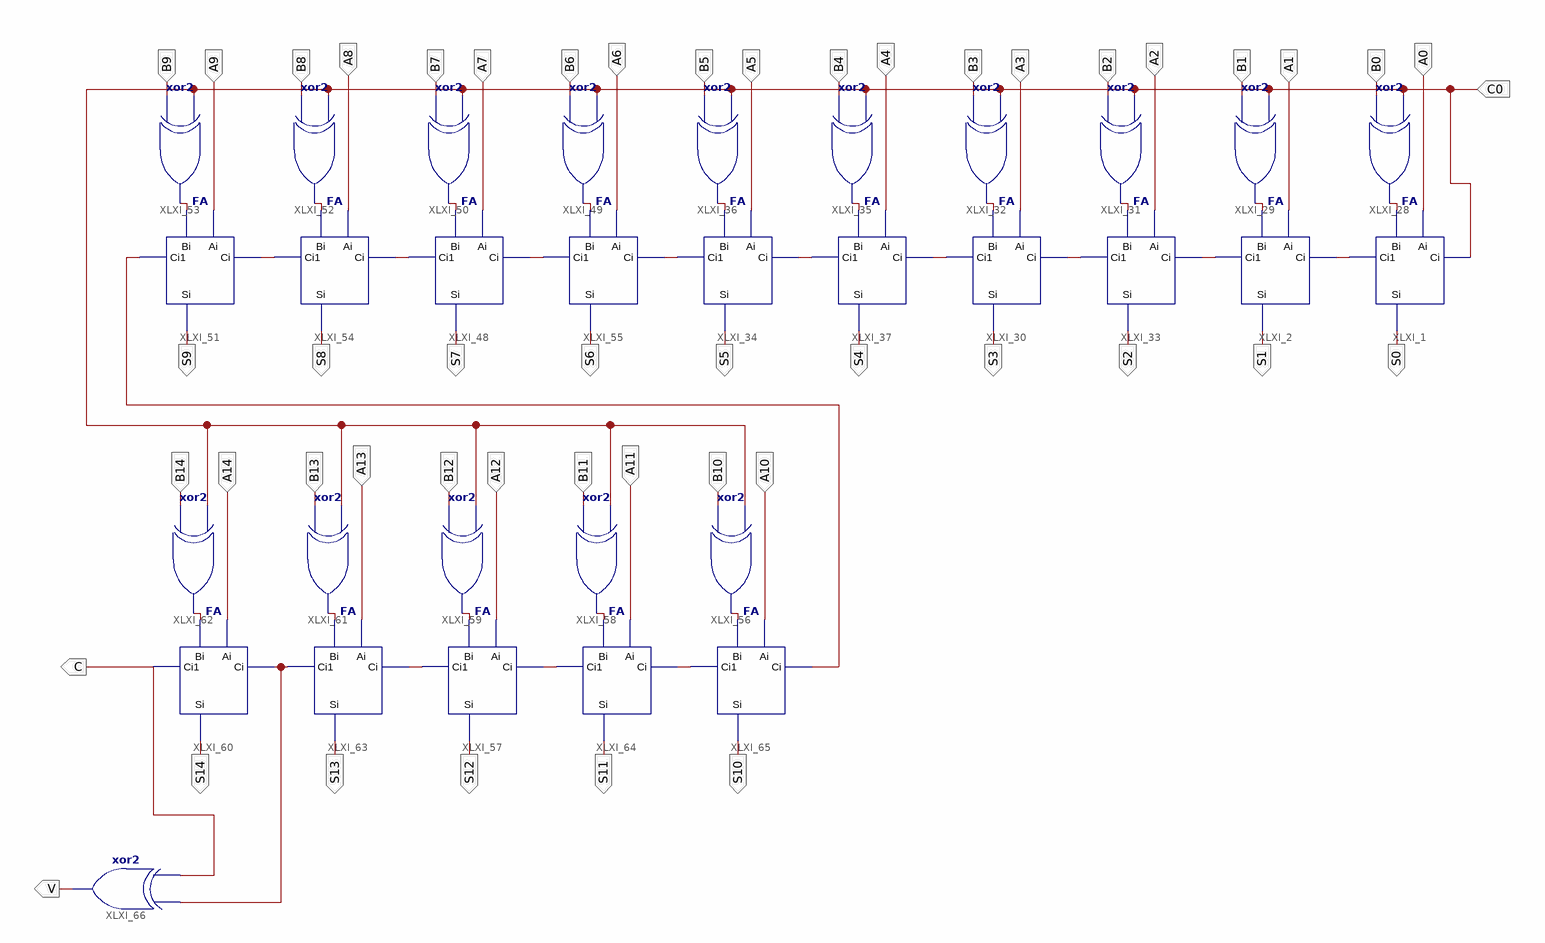
[diagram p0: schematic sheet 1]
// Xilinx ISE schematic schem.sch (spartan3e) as structural Verilog: 31 symbols, 48 ports
module schem (
  input  B0,
  input  A0,
  input  C0,
  input  B1,
  input  A1,
  input  B2,
  input  A2,
  input  B3,
  input  A3,
  input  B4,
  input  A4,
  input  B5,
  input  A5,
  input  B6,
  input  A6,
  input  B7,
  input  A7,
  input  B8,
  input  A8,
  input  B9,
  input  A9,
  input  B10,
  input  A10,
  input  B11,
  input  A11,
  input  B12,
  input  A12,
  input  B13,
  input  A13,
  input  B14,
  input  A14,
  output C,
  output S0,
  output S1,
  output S2,
  output S3,
  output S4,
  output S5,
  output S6,
  output S7,
  output S8,
  output S9,
  output S10,
  output S11,
  output S12,
  output S13,
  output S14,
  output V
);

  wire XLXN_1, XLXN_2, XLXN_22, XLXN_38, XLXN_43, XLXN_44, XLXN_45, XLXN_48, XLXN_51, XLXN_52, XLXN_53,
       XLXN_56, XLXN_79, XLXN_80, XLXN_81, XLXN_84, XLXN_87, XLXN_88, XLXN_89, XLXN_92, XLXN_95, XLXN_96,
       XLXN_99, XLXN_100, XLXN_101, XLXN_104, XLXN_107, XLXN_109, XLXN_112;

  FA XLXI_1 (.Ai(A0), .Bi(XLXN_22), .Ci(C0), .Ci1(XLXN_1), .Si(S0));
  FA XLXI_2 (.Ai(A1), .Bi(XLXN_38), .Ci(XLXN_1), .Ci1(XLXN_2), .Si(S1));
  xor XLXI_28 (XLXN_22, B0, C0);
  xor XLXI_29 (XLXN_38, B1, C0);
  FA XLXI_30 (.Ai(A3), .Bi(XLXN_48), .Ci(XLXN_43), .Ci1(XLXN_44), .Si(S3));
  xor XLXI_31 (XLXN_45, B2, C0);
  xor XLXI_32 (XLXN_48, B3, C0);
  FA XLXI_33 (.Ai(A2), .Bi(XLXN_45), .Ci(XLXN_2), .Ci1(XLXN_43), .Si(S2));
  FA XLXI_34 (.Ai(A5), .Bi(XLXN_56), .Ci(XLXN_51), .Ci1(XLXN_52), .Si(S5));
  xor XLXI_35 (XLXN_53, B4, C0);
  xor XLXI_36 (XLXN_56, B5, C0);
  FA XLXI_37 (.Ai(A4), .Bi(XLXN_53), .Ci(XLXN_44), .Ci1(XLXN_51), .Si(S4));
  FA XLXI_48 (.Ai(A7), .Bi(XLXN_84), .Ci(XLXN_79), .Ci1(XLXN_80), .Si(S7));
  xor XLXI_49 (XLXN_81, B6, C0);
  xor XLXI_50 (XLXN_84, B7, C0);
  FA XLXI_51 (.Ai(A9), .Bi(XLXN_92), .Ci(XLXN_87), .Ci1(XLXN_88), .Si(S9));
  xor XLXI_52 (XLXN_89, B8, C0);
  xor XLXI_53 (XLXN_92, B9, C0);
  FA XLXI_54 (.Ai(A8), .Bi(XLXN_89), .Ci(XLXN_80), .Ci1(XLXN_87), .Si(S8));
  FA XLXI_55 (.Ai(A6), .Bi(XLXN_81), .Ci(XLXN_52), .Ci1(XLXN_79), .Si(S6));
  xor XLXI_56 (XLXN_96, B10, C0);
  FA XLXI_57 (.Ai(A12), .Bi(XLXN_104), .Ci(XLXN_99), .Ci1(XLXN_100), .Si(S12));
  xor XLXI_58 (XLXN_101, B11, C0);
  xor XLXI_59 (XLXN_104, B12, C0);
  FA XLXI_60 (.Ai(A14), .Bi(XLXN_112), .Ci(XLXN_107), .Ci1(C), .Si(S14));
  xor XLXI_61 (XLXN_109, B13, C0);
  xor XLXI_62 (XLXN_112, B14, C0);
  FA XLXI_63 (.Ai(A13), .Bi(XLXN_109), .Ci(XLXN_100), .Ci1(XLXN_107), .Si(S13));
  FA XLXI_64 (.Ai(A11), .Bi(XLXN_101), .Ci(XLXN_95), .Ci1(XLXN_99), .Si(S11));
  FA XLXI_65 (.Ai(A10), .Bi(XLXN_96), .Ci(XLXN_88), .Ci1(XLXN_95), .Si(S10));
  xor XLXI_66 (V, C, XLXN_107);
endmodule
